# EAGLE design BlinkenPanel (EAGLE 9.6.2)
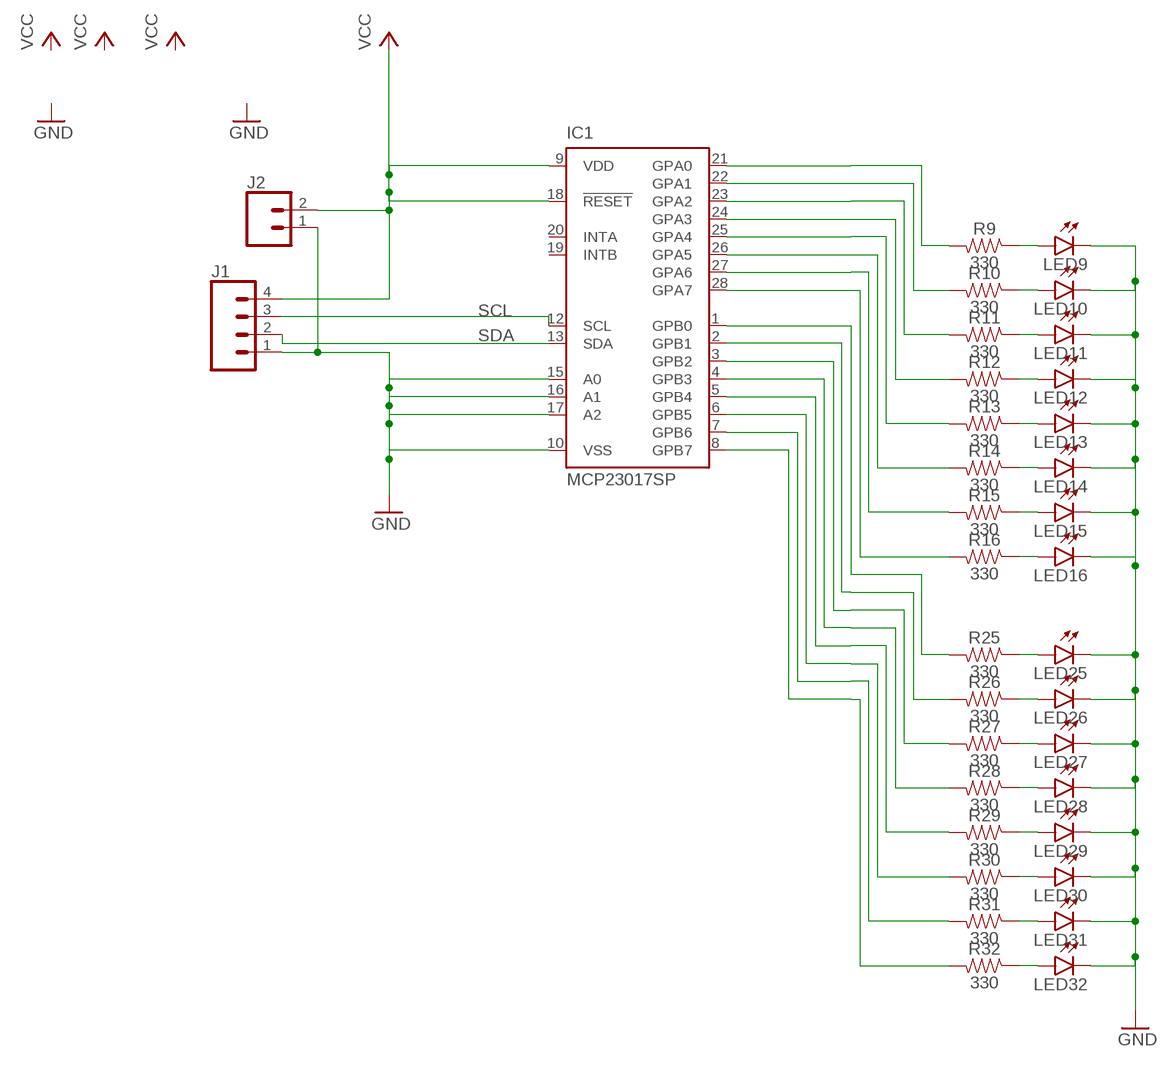
[diagram p0: schematic, sheet 1]

## Parts
IC1  MCP23017SP  [DIL28-3]
J1  CONN_04LOCK  [1X04_LOCK]
J2  CONN_02  [1X02]
LED9  LED3MM  [LED3MM]
LED10  LED3MM  [LED3MM]
LED11  LED3MM  [LED3MM]
LED12  LED3MM  [LED3MM]
LED13  LED3MM  [LED3MM]
LED14  LED3MM  [LED3MM]
LED15  LED3MM  [LED3MM]
LED16  LED3MM  [LED3MM]
LED25  LED3MM  [LED3MM]
LED26  LED3MM  [LED3MM]
LED27  LED3MM  [LED3MM]
LED28  LED3MM  [LED3MM]
LED29  LED3MM  [LED3MM]
LED30  LED3MM  [LED3MM]
LED31  LED3MM  [LED3MM]
LED32  LED3MM  [LED3MM]
R9  330  330OHM-0603-1/10W-1%  [0603]
R10  330  330OHM-0603-1/10W-1%  [0603]
R11  330  330OHM-0603-1/10W-1%  [0603]
R12  330  330OHM-0603-1/10W-1%  [0603]
R13  330  330OHM-0603-1/10W-1%  [0603]
R14  330  330OHM-0603-1/10W-1%  [0603]
R15  330  330OHM-0603-1/10W-1%  [0603]
R16  330  330OHM-0603-1/10W-1%  [0603]
R25  330  330OHM-0603-1/10W-1%  [0603]
R26  330  330OHM-0603-1/10W-1%  [0603]
R27  330  330OHM-0603-1/10W-1%  [0603]
R28  330  330OHM-0603-1/10W-1%  [0603]
R29  330  330OHM-0603-1/10W-1%  [0603]
R30  330  330OHM-0603-1/10W-1%  [0603]
R31  330  330OHM-0603-1/10W-1%  [0603]
R32  330  330OHM-0603-1/10W-1%  [0603]

## Nets
GND: IC1.10(VSS) IC1.15(A0) IC1.16(A1) IC1.17(A2) J1.1 J2.1 LED9.K(C) LED10.K(C) LED11.K(C) LED12.K(C) LED13.K(C) LED14.K(C) LED15.K(C) LED16.K(C) LED25.K(C) LED26.K(C) LED27.K(C) LED28.K(C) LED29.K(C) LED30.K(C) LED31.K(C) LED32.K(C)
N$9: LED9.A R9.1
N$10: LED10.A R10.1
N$11: LED11.A R11.1
N$12: LED12.A R12.1
N$13: LED13.A R13.1
N$14: LED14.A R14.1
N$15: LED15.A R15.1
N$16: LED16.A R16.1
N$25: IC1.21(GPA0) R9.2
N$26: IC1.22(GPA1) R10.2
N$27: IC1.23(GPA2) R11.2
N$28: IC1.24(GPA3) R12.2
N$29: IC1.25(GPA4) R13.2
N$30: IC1.26(GPA5) R14.2
N$31: IC1.27(GPA6) R15.2
N$32: IC1.28(GPA7) R16.2
N$41: LED25.A R25.1
N$42: LED26.A R26.1
N$43: LED27.A R27.1
N$44: LED28.A R28.1
N$45: LED29.A R29.1
N$46: LED30.A R30.1
N$47: LED31.A R31.1
N$48: LED32.A R32.1
N$57: IC1.1(GPB0) R25.2
N$58: IC1.2(GPB1) R26.2
N$59: IC1.3(GPB2) R27.2
N$60: IC1.4(GPB3) R28.2
N$61: IC1.5(GPB4) R29.2
N$62: IC1.6(GPB5) R30.2
N$63: IC1.7(GPB6) R31.2
N$64: IC1.8(GPB7) R32.2
SCL: IC1.12(SCL) J1.3
SDA: IC1.13(SDA) J1.2
VCC: IC1.9(VDD) IC1.18(!RESET) J1.4 J2.2
Unconnected: IC1.19(INTB) IC1.20(INTA)

## Library data of the parts
IC1 = microchip:MCP23017: http://ww1.microchip.com/downloads/en/DeviceDoc/21952a.pdf Source: http://ww1.microchip.com/downloads/en/DeviceDoc/21952a.pdf; MF: MICROCHIP; MPN: MCP23017-E/SP; OC_FARNELL: 1332088; OC_NEWARK: 31K2959
J1 = SparkFun-Connectors:CONN_04: Multi connection point. Often used as Generic Header-pin footprint for 0.1 inch spaced/style header connections On any of the 0.1 inch spaced packages, you can populate with these: Break Away Headers - Straight <https://www.sparkfun.com/products/116> (PRT-00116) Break Away Male Headers - Right Angle <https://www.sparkfun.com/products/553> (PRT-00553) Female Headers <https://www.sparkfun.com/products/115> (PRT-00115) Break Away Headers - Machine Pin <https://www.sparkfun.com/products/117> (PRT-00117) Break Away Female Headers - Swiss Machine Pin <https://www.sparkfun.com/products/743> (PRT-00743) For SCREWTERMINALS and SPRING TERMINALS visit here: Screw Terimnals on SparkFun.com <https://www.sparkfun.com/search/results?term=Screw+Terminals> (5mm/3.5mm/2.54mm spacing) This device is also useful as a general connection point to wire up your design to another part of your project. Our various solder wires solder well into these plated through hole pads. Hook-Up Wire - Assortment (Stranded, 22 AWG) <https://www.sparkfun.com/products/11375> (PRT-11375) Hook-Up Wire - Assortment (Solid Core, 22 AWG) <https://www.sparkfun.com/products/11367> (PRT-11367) View the entire wire category on our website here <https://www.sparkfun.com/categories/141> Special notes: Molex polarized connector foot print use with SKU : PRT-08231 with associated crimp pins and housings. 1MM SMD Version SKU: PRT-10208; PROD_ID: CONN-09696
J2 = SparkFun-Connectors:CONN_02: Multi connection point. Often used as Generic Header-pin footprint for 0.1 inch spaced/style header connections On any of the 0.1 inch spaced packages, you can populate with these: Break Away Headers - Straight <https://www.sparkfun.com/products/116> (PRT-00116) Break Away Male Headers - Right Angle <https://www.sparkfun.com/products/553> (PRT-00553) Female Headers <https://www.sparkfun.com/products/115> (PRT-00115) Break Away Headers - Machine Pin <https://www.sparkfun.com/products/117> (PRT-00117) Break Away Female Headers - Swiss Machine Pin <https://www.sparkfun.com/products/743> (PRT-00743) For SCREWTERMINALS and SPRING TERMINALS visit here: Screw Terimnals on SparkFun.com <https://www.sparkfun.com/search/results?term=Screw+Terminals> (5mm/3.5mm/2.54mm spacing) This device is also useful as a general connection point to wire up your design to another part of your project. Our various solder wires solder well into these plated through hole pads. Hook-Up Wire - Assortment (Stranded, 22 AWG) <https://www.sparkfun.com/products/11375> (PRT-11375) Hook-Up Wire - Assortment (Solid Core, 22 AWG) <https://www.sparkfun.com/products/11367> (PRT-11367) View the entire wire category on our website here <https://www.sparkfun.com/categories/141> Special notes: Molex polarized connector foot print use with: PRT-08233 with associated crimp pins and housings. 2.54_SCREWTERM for use with PRT-10571. 3.5mm Screw Terminal footprints for PRT-08084 5mm Screw Terminal footprints for use with PRT-08432
LED9-LED16 LED25-LED32 = led:LED: LED OSRAM: - CHIPLED LG R971, LG N971, LY N971, LG Q971, LY Q971, LO R971, LY R971 LH N974, LH R974 LS Q976, LO Q976, LY Q976 LO Q996 - Hyper CHIPLED LW Q18S LB Q993, LB Q99A, LB R99A - SideLED LS A670, LO A670, LY A670, LG A670, LP A670 LB A673, LV A673, LT A673, LW A673 LH A674 LY A675 LS A676, LA A676, LO A676, LY A676, LW A676 LS A679, LY A679, LG A679 - Hyper Micro SIDELED® LS Y876, LA Y876, LO Y876, LY Y876 LT Y87S - SmartLED LW L88C, LW L88S LB L89C, LB L89S, LG L890 LS L89K, LO L89K, LY L89K LS L896, LA L896, LO L896, LY L896 - TOPLED LS T670, LO T670, LY T670, LG T670, LP T670 LSG T670, LSP T670, LSY T670, LOP T670, LYG T670 LG T671, LOG T671, LSG T671 LB T673, LV T673, LT T673, LW T673 LH T674 LS T676, LA T676, LO T676, LY T676, LB T676, LH T676, LSB T676, LW T676 LB T67C, LV T67C, LT T67C, LS T67K, LO T67K, LY T67K, LW E67C LS E67B, LA E67B, LO E67B, LY E67B, LB E67C, LV E67C, LT E67C LW T67C LS T679, LY T679, LG T679 LS T770, LO T770, LY T770, LG T770, LP T770 LB T773, LV T773, LT T773, LW T773 LH T774 LS E675, LA E675, LY E675, LS T675 LS T776, LA T776, LO T776, LY T776, LB T776 LHGB T686 LT T68C, LB T68C - Hyper Mini TOPLED® LB M676 - Mini TOPLED Santana® LG M470 LS M47K, LO M47K, LY M47K Source: http://www.osram.convergy.de LUXEON: - LUMILED® LXK2-PW12-R00, LXK2-PW12-S00, LXK2-PW14-U00, LXK2-PW14-V00 LXK2-PM12-R00, LXK2-PM12-S00, LXK2-PM14-U00 LXK2-PE12-Q00, LXK2-PE12-R00, LXK2-PE12-S00, LXK2-PE14-T00, LXK2-PE14-U00 LXK2-PB12-K00, LXK2-PB12-L00, LXK2-PB12-M00, LXK2-PB14-N00, LXK2-PB14-P00, LXK2-PB14-Q00 LXK2-PR12-L00, LXK2-PR12-M00, LXK2-PR14-Q00, LXK2-PR14-R00 LXK2-PD12-Q00, LXK2-PD12-R00, LXK2-PD12-S00 LXK2-PH12-R00, LXK2-PH12-S00 LXK2-PL12-P00, LXK2-PL12-Q00, LXK2-PL12-R00 Source: www.luxeon.com KINGBRIGHT: KA-3528ASYC Source: www.kingbright.com
R9-R16 R25-R32 = SparkFun-Resistors:330OHM: 330Ω resistor A resistor is a passive two-terminal electrical component that implements electrical resistance as a circuit element. Resistors act to reduce current flow, and, at the same time, act to lower voltage levels within circuits. - Wikipedia; PROD_ID: RES-00818

## Board
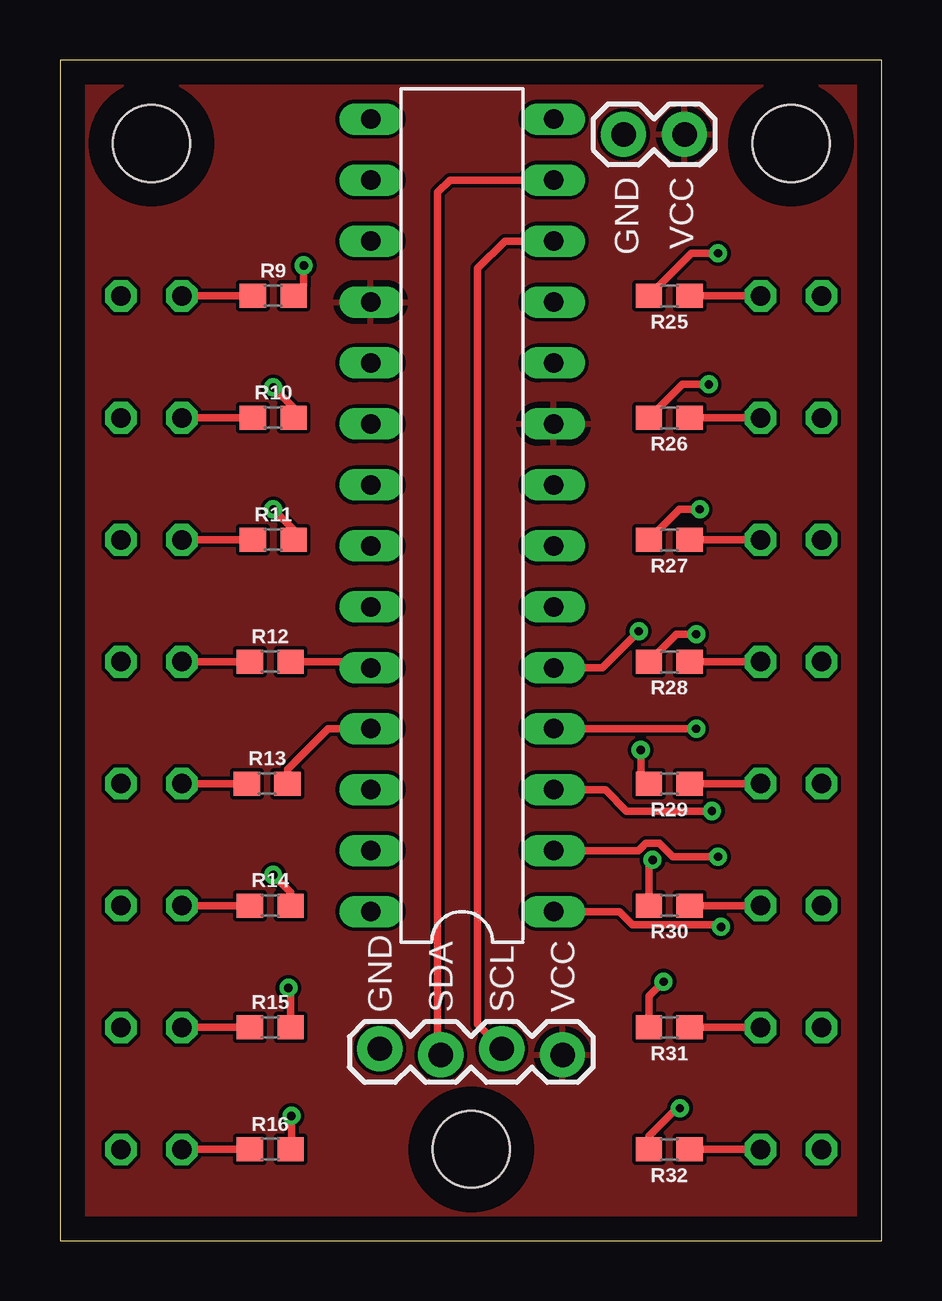
[diagram p1: board, top side]
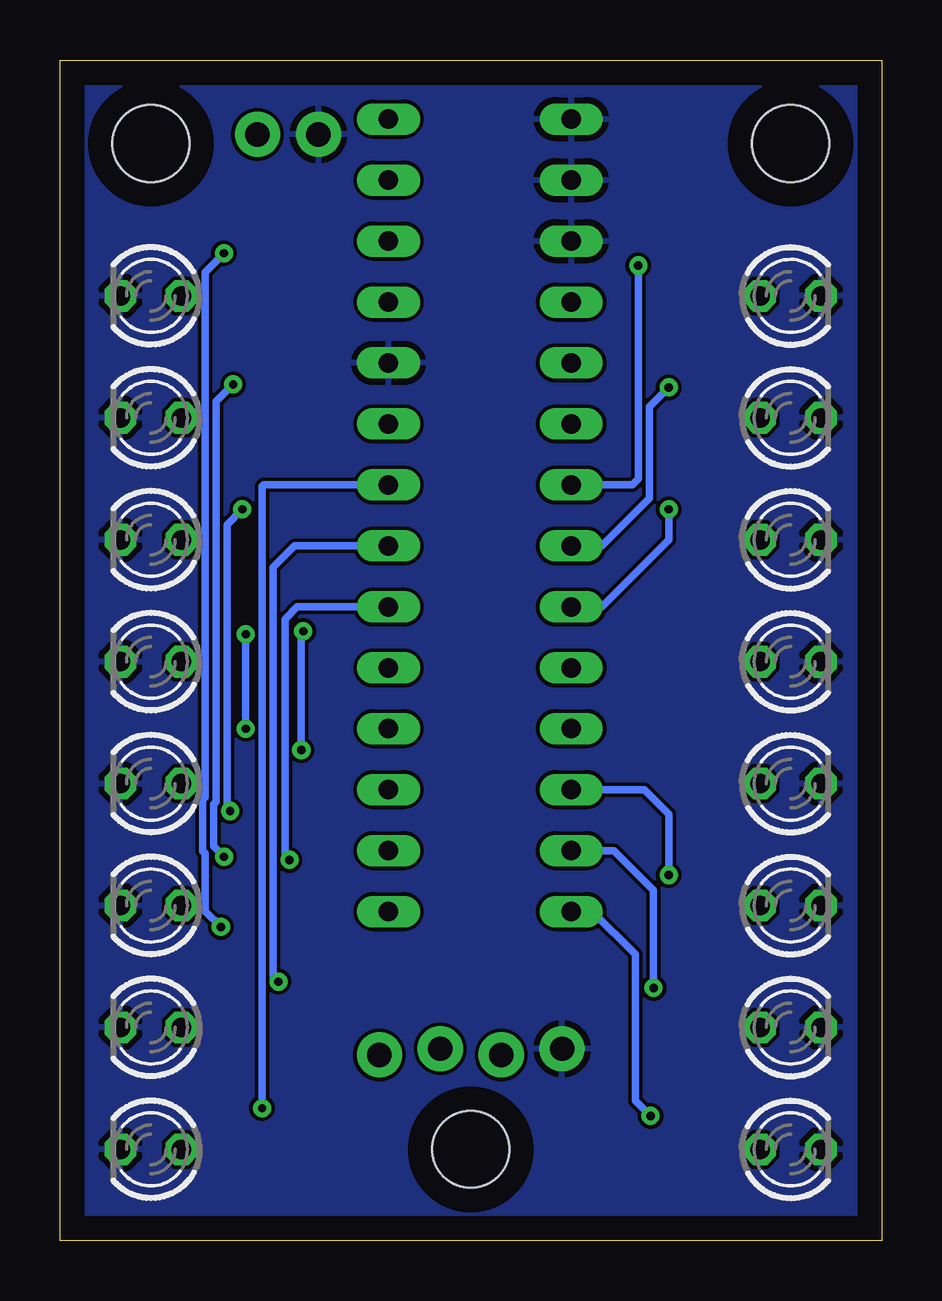
[diagram p2: board, bottom side, seen from below]

Size 34.27 x 49.2 mm. Coordinates in mm from the lower left corner, seen from the top.
Outline: 0,0 34.27,0 34.27,49.2 0,49.2 0,0
Copper layers (1*16): Top 0.035mm / dielectric 1.5mm / Bottom 0.035mm
Design rules "default": minimum track width 6mil, minimum drill 0.35mm, track to track 6mil, track to pad 6mil, pad to pad 6mil, via to via 6mil, smd to smd 6mil, copper to edge 40mil, drill to drill 6mil, minimum pad ring 10mil, minimum via ring 8mil, stop-mask expansion 4mil, vias tented up to drill 0mil, thermal gap 10mil
Holes 3.2 mm at 17.14,3.81 30.48,45.72 3.81,45.72

### Footprints (pad centres in the part's own frame; a part is rotated, then mirrored left to right if it is on the bottom)
DIL28-3 = drill 0.813 long: 1 -16.51,-3.81; 2 -13.97,-3.81; 3 -11.43,-3.81; 4 -8.89,-3.81; 5 -6.35,-3.81; 6 -3.81,-3.81; 7 -1.27,-3.81; 8 1.27,-3.81; 9 3.81,-3.81; 10 6.35,-3.81; 11 8.89,-3.81; 12 11.43,-3.81; 13 13.97,-3.81; 14 16.51,-3.81; 15 16.51,3.81; 16 13.97,3.81; 17 11.43,3.81; 18 8.89,3.81; 19 6.35,3.81; 20 3.81,3.81; 21 1.27,3.81; 22 -1.27,3.81; 23 -3.81,3.81; 24 -6.35,3.81; 25 -8.89,3.81; 26 -11.43,3.81; 27 -13.97,3.81; 28 -16.51,3.81
1X04_LOCK = drill 1.016 pad 1.88: 1 0,0.127; 2 2.54,-0.127; 3 5.08,0.127; 4 7.62,-0.127
1X02 = drill 1.016 pad 1.88: 1 0,0; 2 2.54,0
LED3MM = drill 0.813 octagon: A -1.27,0; K 1.27,0
0603 = smd 1.1 x 1: 1 -0.85,0; 2 0.85,0

### Placement (x,y rotation side)
IC1  16.76,30.23 90 top
J1  13.34,7.87 0 top
J2  23.5,46.1 0 top
LED9  3.81,39.37 0 bottom
LED10  3.81,34.29 0 bottom
LED11  3.81,29.21 0 bottom
LED12  3.81,24.13 0 bottom
LED13  3.81,19.05 0 bottom
LED14  3.81,13.97 0 bottom
LED15  3.81,8.89 0 bottom
LED16  3.81,3.81 0 bottom
LED25  30.48,39.37 180 bottom
LED26  30.48,34.29 180 bottom
LED27  30.48,29.21 180 bottom
LED28  30.48,24.13 180 bottom
LED29  30.48,19.05 180 bottom
LED30  30.48,13.97 180 bottom
LED31  30.48,8.89 180 bottom
LED32  30.48,3.81 180 bottom
R9  8.89,39.37 0 top
R10  8.89,34.29 0 top
R11  8.89,29.21 0 top
R12  8.76,24.13 0 top
R13  8.64,19.05 0 top
R14  8.76,13.97 0 top
R15  8.76,8.89 0 top
R16  8.76,3.81 0 top
R25  25.4,39.37 180 top
R26  25.4,34.29 180 top
R27  25.4,29.21 180 top
R28  25.4,24.13 180 top
R29  25.4,19.05 180 top
R30  25.4,13.97 180 top
R31  25.4,8.89 180 top
R32  25.4,3.81 180 top

### Tracks (layer width: path | path; a pad name or v marks a point on that pad's centre or on a via)
GND
  pour Bottom: 0.13,49.15 34.16,49.15 34.16,0.13 0.13,0.13
N$9
  Top 0.305: R9.1 LED9.A
N$10
  Top 0.305: R10.1 LED10.A
N$11
  Top 0.305: R11.1 LED11.A
N$12
  Top 0.305: R12.1 LED12.A
N$13
  Top 0.305: R13.1 LED13.A
N$14
  Top 0.305: R14.1 LED14.A
N$15
  Top 0.305: R15.1 LED15.A
N$16
  Top 0.305: R16.1 LED16.A
N$25  (via drill 0.35)
  Top 0.305: v10.16,40.64 10.16,39.79 R9.2
  Bottom 0.305: IC1.21 10.41,31.5 10.16,31.75 v10.16,40.64
N$26  (via drill 0.35)
  Top 0.305: v8.89,35.56 9.74,34.71 R10.2
  Bottom 0.305: IC1.22 11.68,28.96 9.7,30.94 9.7,34.75 v8.89,35.56
N$27  (via drill 0.35)
  Top 0.305: v8.89,30.48 9.74,29.63 R11.2
  Bottom 0.305: IC1.23 11.68,26.42 10.16,27.94 8.89,29.21 v8.89,30.48
N$28
  Top 0.305: IC1.24 12.7,24.13 R12.2
N$29
  Top 0.305: IC1.25 11.18,21.34 9.49,19.65 R13.2
N$30  (via drill 0.35)
  Top 0.305: v8.89,15.24 9.61,14.52 R14.2
  Bottom 0.305: IC1.26 9.91,18.8 8.89,17.78 v8.89,15.24
N$31  (via drill 0.35)
  Top 0.305: v9.53,10.54 9.61,10.45 R15.2
  Bottom 0.305: IC1.27 11.18,16.26 9.53,14.61 v9.53,10.54
N$32  (via drill 0.35)
  Top 0.305: v9.65,5.21 9.65,3.85 R16.2
  Bottom 0.305: IC1.28 12.06,13.72 10.29,11.94 10.29,5.84 v9.65,5.21
N$41
  Top 0.305: LED25.A R25.1
N$42
  Top 0.305: R26.1 LED26.A
N$43
  Top 0.305: R27.1 LED27.A
N$44
  Top 0.305: R28.1 LED28.A
N$45
  Top 0.305: R29.1 LED29.A
N$46
  Top 0.305: R30.1 LED30.A
N$47
  Top 0.305: R31.1 LED31.A
N$48
  Top 0.305: R32.1 LED32.A
N$57  (via drill 0.35)
  Top 0.305: R25.2 26.33,41.15 v27.43,41.15 | IC1.1 23.32,13.72 23.87,13.16 27.48,13.16 v27.56,13.08
  Bottom 0.305: v27.43,41.15 28.22,40.36 28.22,18.48 28.32,18.38 28.32,16.24 28.22,16.14 28.22,13.74 v27.56,13.08
N$58  (via drill 0.35)
  Top 0.305: R26.2 25.95,35.69 v27.05,35.69 | v27.43,16 25.54,16 24.99,16.56 24.42,16.56 24.12,16.26 IC1.2
  Bottom 0.305: v27.05,35.69 27.76,34.98 27.76,18.29 27.86,18.19 27.86,16.43 v27.43,16
N$59  (via drill 0.35)
  Top 0.305: R27.2 25.82,30.48 v26.67,30.48 | v27.18,17.91 23.62,17.91 22.73,18.8 IC1.3
  Bottom 0.305: v26.67,30.48 27.3,29.84 27.3,18.03 v27.18,17.91
N$60  (via drill 0.35)
  Top 0.305: R28.2 25.69,25.27 v26.53,25.27 | v26.53,21.34 IC1.4
  Bottom 0.305: v26.53,25.27 v26.53,21.34
N$61  (via drill 0.35)
  Top 0.305: R29.2 24.21,19.39 v24.21,20.45 | v24.13,25.4 22.61,23.88 IC1.5
  Bottom 0.305: v24.21,20.45 24.21,25.32 v24.13,25.4
N$62  (via drill 0.35)
  Top 0.305: R30.2 24.55,15.72 v24.7,15.88
  Bottom 0.305: v24.7,15.88 24.89,16.06 24.89,25.91 24.38,26.42 IC1.6
N$63  (via drill 0.35)
  Top 0.305: R31.2 24.55,10.18 v25.16,10.79
  Bottom 0.305: v25.16,10.79 25.39,11.02 25.39,28.07 24.5,28.96 IC1.7
N$64  (via drill 0.35)
  Top 0.305: R32.2 24.55,4.36 25.78,5.59 v25.84,5.52
  Bottom 0.305: v25.84,5.52 25.84,31.43 25.78,31.5 IC1.8
SCL
  Top 0.305: J1.3 17.4,9.02 17.4,40.51 18.54,41.66 IC1.12
SDA
  Top 0.305: IC1.13 16.26,44.2 15.75,43.69 15.75,7.87 J1.2
VCC
  pour Top: 0.13,49.15 34.29,49.15 34.29,0 0.13,0

### Text on the board
tPlace: GND | VCC | GND | SDA | SCL | VCC